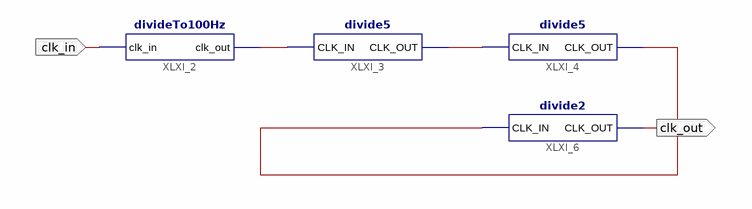
[diagram p0: schematic sheet 1]
// Xilinx ISE schematic divideTo2Hz.sch (spartan6) as structural Verilog: 4 symbols, 2 ports
module divideTo2Hz (
  input  clk_in,
  output clk_out
);

  wire XLXN_1, XLXN_2, XLXN_3;

  divideTo100Hz XLXI_2 (.clk_in(clk_in), .clk_out(XLXN_1));
  divide5 XLXI_3 (.CLK_IN(XLXN_1), .CLK_OUT(XLXN_2));
  divide5 XLXI_4 (.CLK_IN(XLXN_2), .CLK_OUT(XLXN_3));
  divide2 XLXI_6 (.CLK_IN(XLXN_3), .CLK_OUT(clk_out));
endmodule
